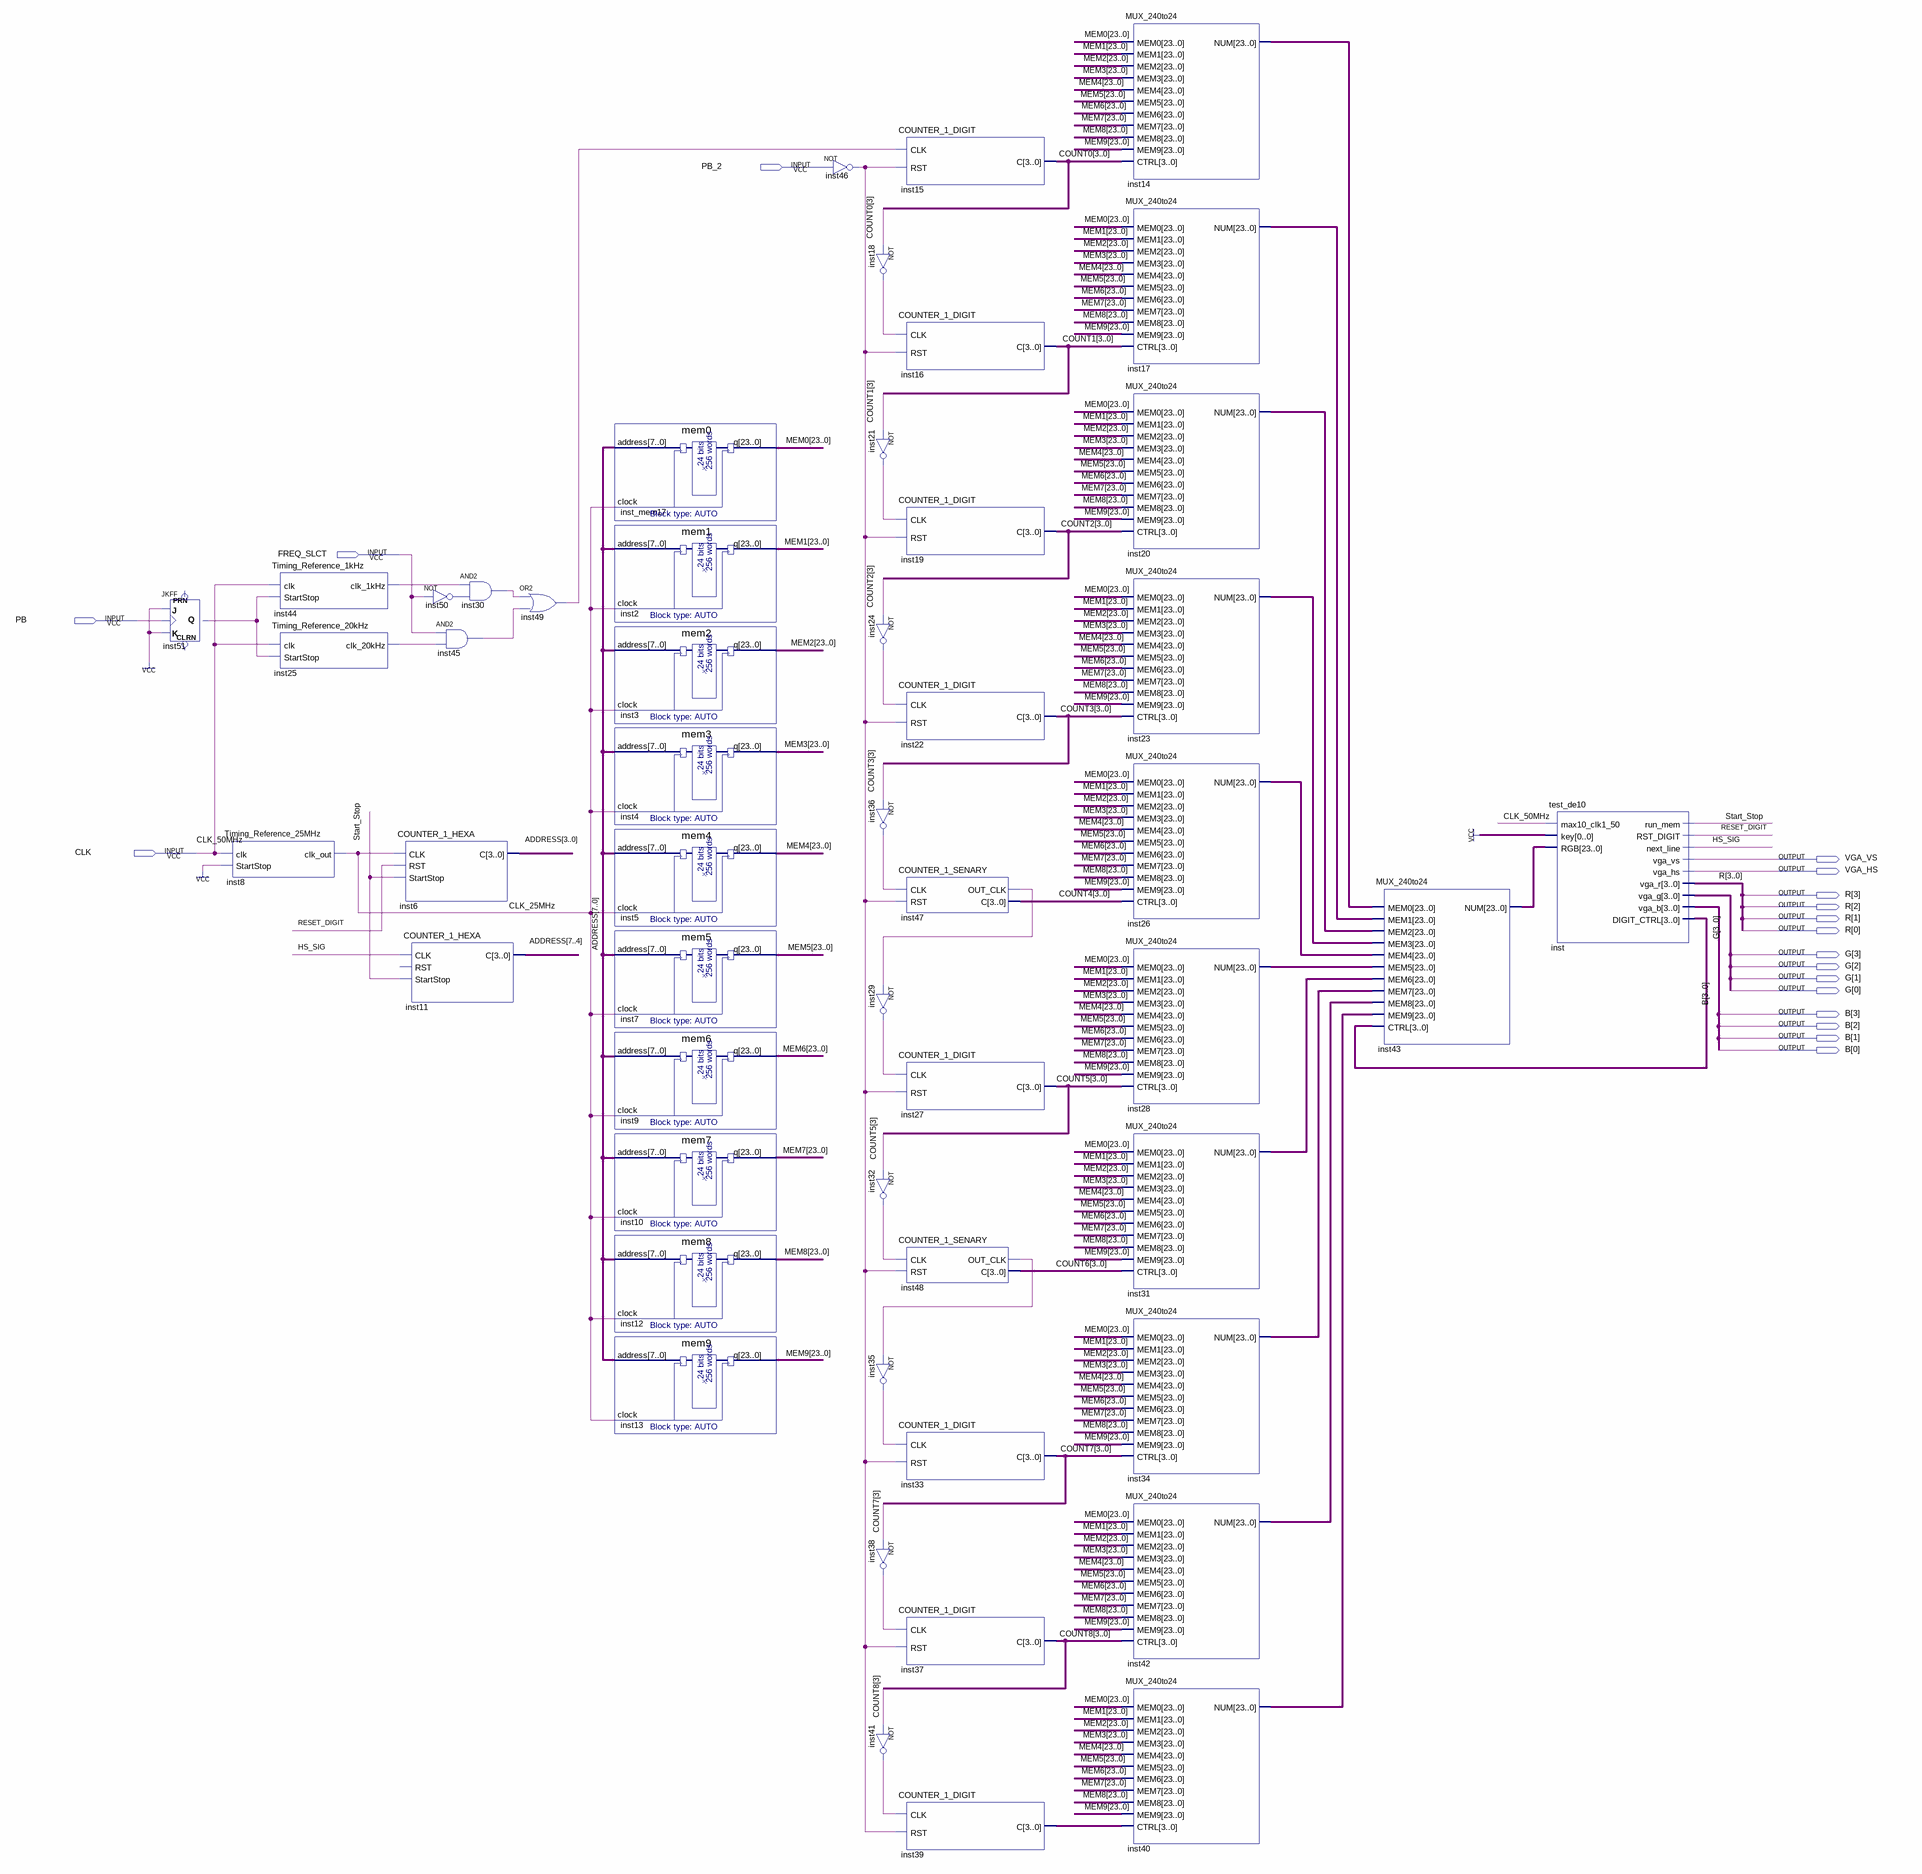
[diagram p0: schematic sheet]
// Quartus schematic main.bdf as structural Verilog: 52 symbols, 18 pins
module main (
  input  PB_2,
  input  FREQ_SLCT,
  input  PB,
  input  CLK,
  output VGA_VS,
  output VGA_HS,
  output [3:0] R,
  output [3:0] G,
  output [3:0] B
);

  wire CLK_25MHz, HS_SIG, inst18_out, inst21_out, inst24_out, inst25_clk_20khz, inst29_out, inst30_out,
       inst32_out, inst35_out, inst36_out, inst38_out, inst41_out, inst44_clk_1khz, inst45_out, inst46_out,
       inst47_out_clk, inst48_out_clk, inst49_out, inst50_out, inst51_q, RESET_DIGIT, Start_Stop;
  wire [3:0] COUNT0, COUNT1, COUNT2, COUNT3, COUNT4, COUNT5, COUNT6, COUNT7, COUNT8, inst39_c,
       inst_digit_ctrl;
  wire [7:0] ADDRESS;
  wire [23:0] inst14_num, inst17_num, inst20_num, inst23_num, inst26_num, inst28_num, inst31_num, inst34_num,
       inst40_num, inst42_num, inst43_num, MEM0, MEM1, MEM2, MEM3, MEM4, MEM5, MEM6, MEM7, MEM8, MEM9;

  JKFF inst51 (.K(1'b1), .J(1'b1), .CLK(PB), .Q(inst51_q));  // open: PRN, CLRN
  Timing_Reference_25MHz inst8 (.clk(CLK), .StartStop(1'b1), .clk_out(CLK_25MHz));
  Timing_Reference_1kHz inst44 (.clk(CLK), .StartStop(inst51_q), .clk_1kHz(inst44_clk_1khz));
  Timing_Reference_20kHz inst25 (.clk(CLK), .StartStop(inst51_q), .clk_20kHz(inst25_clk_20khz));
  not inst50 (inst50_out, FREQ_SLCT);
  and inst45 (inst45_out, FREQ_SLCT, inst25_clk_20khz);
  COUNTER_1_HEXA inst6 (.CLK(CLK_25MHz), .RST(RESET_DIGIT), .StartStop(Start_Stop), .C(ADDRESS[3:0]));
  COUNTER_1_HEXA inst11 (.CLK(HS_SIG), .StartStop(Start_Stop), .C(ADDRESS[7:4]));  // open: RST
  and inst30 (inst30_out, inst44_clk_1khz, inst50_out);
  or inst49 (inst49_out, inst30_out, inst45_out);
  mem0 inst_mem17 (.address(ADDRESS), .clock(CLK_25MHz), .q(MEM0));
  mem1 inst2 (.address(ADDRESS), .clock(CLK_25MHz), .q(MEM1));
  mem2 inst3 (.address(ADDRESS), .clock(CLK_25MHz), .q(MEM2));
  mem3 inst4 (.address(ADDRESS), .clock(CLK_25MHz), .q(MEM3));
  mem4 inst5 (.address(ADDRESS), .clock(CLK_25MHz), .q(MEM4));
  mem5 inst7 (.address(ADDRESS), .clock(CLK_25MHz), .q(MEM5));
  mem6 inst9 (.address(ADDRESS), .clock(CLK_25MHz), .q(MEM6));
  mem7 inst10 (.address(ADDRESS), .clock(CLK_25MHz), .q(MEM7));
  mem8 inst12 (.address(ADDRESS), .clock(CLK_25MHz), .q(MEM8));
  mem9 inst13 (.address(ADDRESS), .clock(CLK_25MHz), .q(MEM9));
  not inst46 (inst46_out, PB_2);
  COUNTER_1_DIGIT inst15 (.CLK(inst49_out), .RST(inst46_out), .C(COUNT0));
  not inst18 (inst18_out, COUNT0[3]);
  COUNTER_1_DIGIT inst16 (.CLK(inst18_out), .RST(inst46_out), .C(COUNT1));
  not inst21 (inst21_out, COUNT1[3]);
  COUNTER_1_DIGIT inst19 (.CLK(inst21_out), .RST(inst46_out), .C(COUNT2));
  not inst24 (inst24_out, COUNT2[3]);
  COUNTER_1_DIGIT inst22 (.CLK(inst24_out), .RST(inst46_out), .C(COUNT3));
  not inst36 (inst36_out, COUNT3[3]);
  COUNTER_1_SENARY inst47 (.CLK(inst36_out), .RST(inst46_out), .OUT_CLK(inst47_out_clk), .C(COUNT4));
  not inst29 (inst29_out, inst47_out_clk);
  COUNTER_1_DIGIT inst27 (.CLK(inst29_out), .RST(inst46_out), .C(COUNT5));
  not inst32 (inst32_out, COUNT5[3]);
  COUNTER_1_SENARY inst48 (.CLK(inst32_out), .RST(inst46_out), .OUT_CLK(inst48_out_clk), .C(COUNT6));
  not inst35 (inst35_out, inst48_out_clk);
  COUNTER_1_DIGIT inst33 (.CLK(inst35_out), .RST(inst46_out), .C(COUNT7));
  not inst38 (inst38_out, COUNT7[3]);
  COUNTER_1_DIGIT inst37 (.CLK(inst38_out), .RST(inst46_out), .C(COUNT8));
  not inst41 (inst41_out, COUNT8[3]);
  COUNTER_1_DIGIT inst39 (.CLK(inst41_out), .RST(inst46_out), .C(inst39_c));
  MUX_240to24 inst14 (
    .MEM0(MEM0), .MEM1(MEM1), .MEM2(MEM2), .MEM3(MEM3), .MEM4(MEM4), .MEM5(MEM5), .MEM6(MEM6), .MEM7(MEM7),
    .MEM8(MEM8), .MEM9(MEM9), .CTRL(COUNT0), .NUM(inst14_num));
  MUX_240to24 inst17 (
    .MEM0(MEM0), .MEM1(MEM1), .MEM2(MEM2), .MEM3(MEM3), .MEM4(MEM4), .MEM5(MEM5), .MEM6(MEM6), .MEM7(MEM7),
    .MEM8(MEM8), .MEM9(MEM9), .CTRL(COUNT1), .NUM(inst17_num));
  MUX_240to24 inst20 (
    .MEM0(MEM0), .MEM1(MEM1), .MEM2(MEM2), .MEM3(MEM3), .MEM4(MEM4), .MEM5(MEM5), .MEM6(MEM6), .MEM7(MEM7),
    .MEM8(MEM8), .MEM9(MEM9), .CTRL(COUNT2), .NUM(inst20_num));
  MUX_240to24 inst23 (
    .MEM0(MEM0), .MEM1(MEM1), .MEM2(MEM2), .MEM3(MEM3), .MEM4(MEM4), .MEM5(MEM5), .MEM6(MEM6), .MEM7(MEM7),
    .MEM8(MEM8), .MEM9(MEM9), .CTRL(COUNT3), .NUM(inst23_num));
  MUX_240to24 inst26 (
    .MEM0(MEM0), .MEM1(MEM1), .MEM2(MEM2), .MEM3(MEM3), .MEM4(MEM4), .MEM5(MEM5), .MEM6(MEM6), .MEM7(MEM7),
    .MEM8(MEM8), .MEM9(MEM9), .CTRL(COUNT4), .NUM(inst26_num));
  MUX_240to24 inst28 (
    .MEM0(MEM0), .MEM1(MEM1), .MEM2(MEM2), .MEM3(MEM3), .MEM4(MEM4), .MEM5(MEM5), .MEM6(MEM6), .MEM7(MEM7),
    .MEM8(MEM8), .MEM9(MEM9), .CTRL(COUNT5), .NUM(inst28_num));
  MUX_240to24 inst31 (
    .MEM0(MEM0), .MEM1(MEM1), .MEM2(MEM2), .MEM3(MEM3), .MEM4(MEM4), .MEM5(MEM5), .MEM6(MEM6), .MEM7(MEM7),
    .MEM8(MEM8), .MEM9(MEM9), .CTRL(COUNT6), .NUM(inst31_num));
  MUX_240to24 inst34 (
    .MEM0(MEM0), .MEM1(MEM1), .MEM2(MEM2), .MEM3(MEM3), .MEM4(MEM4), .MEM5(MEM5), .MEM6(MEM6), .MEM7(MEM7),
    .MEM8(MEM8), .MEM9(MEM9), .CTRL(COUNT7), .NUM(inst34_num));
  MUX_240to24 inst42 (
    .MEM0(MEM0), .MEM1(MEM1), .MEM2(MEM2), .MEM3(MEM3), .MEM4(MEM4), .MEM5(MEM5), .MEM6(MEM6), .MEM7(MEM7),
    .MEM8(MEM8), .MEM9(MEM9), .CTRL(COUNT8), .NUM(inst42_num));
  MUX_240to24 inst40 (
    .MEM0(MEM0), .MEM1(MEM1), .MEM2(MEM2), .MEM3(MEM3), .MEM4(MEM4), .MEM5(MEM5), .MEM6(MEM6), .MEM7(MEM7),
    .MEM8(MEM8), .MEM9(MEM9), .CTRL(inst39_c), .NUM(inst40_num));
  MUX_240to24 inst43 (
    .MEM0(inst14_num), .MEM1(inst17_num), .MEM2(inst20_num), .MEM3(inst23_num), .MEM4(inst26_num),
    .MEM5(inst28_num), .MEM6(inst31_num), .MEM7(inst34_num), .MEM8(inst42_num), .MEM9(inst40_num),
    .CTRL(inst_digit_ctrl), .NUM(inst43_num));
  test_de10 inst (
    .max10_clk1_50(CLK), .key(1'b1), .RGB(inst43_num), .run_mem(Start_Stop), .RST_DIGIT(RESET_DIGIT),
    .next_line(HS_SIG), .vga_vs(VGA_VS), .vga_hs(VGA_HS), .vga_r(R), .vga_g(G), .vga_b(B),
    .DIGIT_CTRL(inst_digit_ctrl));

  // Other names for the same wires on the sheet: CLK_50MHz = CLK
endmodule
